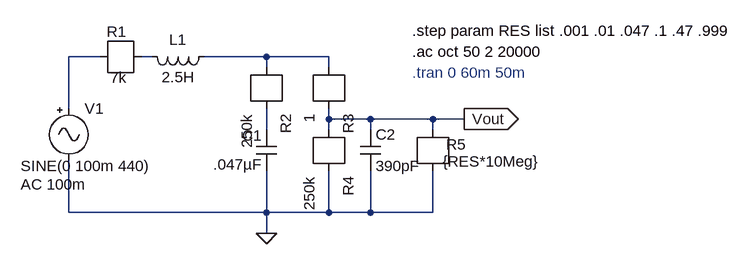
[diagram p0: schematic guitar.asc]
guitar.asc, the LTspice schematic file:
Version 4
SHEET 1 1056 680
WIRE -128 112 -176 112
WIRE -48 112 -64 112
WIRE 128 112 32 112
WIRE 224 112 128 112
WIRE 128 128 128 112
WIRE 224 128 224 112
WIRE -176 192 -176 112
WIRE 224 208 224 192
WIRE 288 208 224 208
WIRE 384 208 288 208
WIRE 432 208 384 208
WIRE 128 224 128 192
WIRE 224 224 224 208
WIRE 288 224 288 208
WIRE 384 224 384 208
WIRE -176 352 -176 272
WIRE 128 352 128 288
WIRE 128 352 -176 352
WIRE 224 352 224 288
WIRE 224 352 128 352
WIRE 288 352 288 288
WIRE 288 352 224 352
WIRE 384 352 384 288
WIRE 384 352 288 352
WIRE 128 384 128 352
FLAG 432 208 Vout
IOPIN 432 208 Out
FLAG 128 384 0
SYMBOL r -128 112 R0
WINDOW 0 41 -39 Right 2
WINDOW 3 41 32 Right 2
SYMATTR InstName R1
SYMATTR Value 7k
SYMBOL r 128 128 R90
SYMATTR InstName R2
SYMATTR Value 250k
SYMBOL r 224 128 R90
SYMATTR InstName R3
SYMATTR Value 1
SYMBOL r 224 224 R90
SYMATTR InstName R4
SYMATTR Value 250k
SYMBOL r 384 224 R90
WINDOW 0 23 -51 VRight 2
WINDOW 3 49 -164 VRight 2
SYMATTR InstName R5
SYMATTR Value {RES*10Meg}
SYMBOL ind 48 96 R90
WINDOW 0 5 56 VBottom 2
WINDOW 3 32 56 VTop 2
SYMATTR InstName L1
SYMATTR Value 2.5H
SYMBOL cap 112 224 R0
WINDOW 0 -21 9 Left 2
WINDOW 3 -66 54 Left 2
SYMATTR InstName C1
SYMATTR Value .047µF
SYMBOL cap 272 224 R0
SYMATTR InstName C2
SYMATTR Value 390pF
SYMBOL signal -176 176 R0
WINDOW 3 -74 104 Left 2
WINDOW 123 -74 133 Left 2
SYMATTR Value SINE(0 100m 440)
SYMATTR Value2 AC 100m
SYMATTR InstName V1
TEXT 352 72 Left 2 !.step param RES list .001 .01 .047 .1 .47 .999
TEXT 352 104 Left 2 !.ac oct 50 2 20000
TEXT 352 136 Left 2 ;.tran 0 60m 50m

The netlist it stands for:
* guitar.asc
R1 N002 N001 7k
R2 N004 N003 250k
R3 Vout N003 1
R4 0 Vout 250k
R5 0 Vout {RES*10Meg}
L1 N003 N002 2.5H
C1 N004 0 .047µF
C2 Vout 0 390pF
V1 N001 0 SINE(0 100m 440) AC 100m
.step param RES list .001 .01 .047 .1 .47 .999
.ac oct 50 2 20000
* .tran 0 60m 50m
.backanno
.end